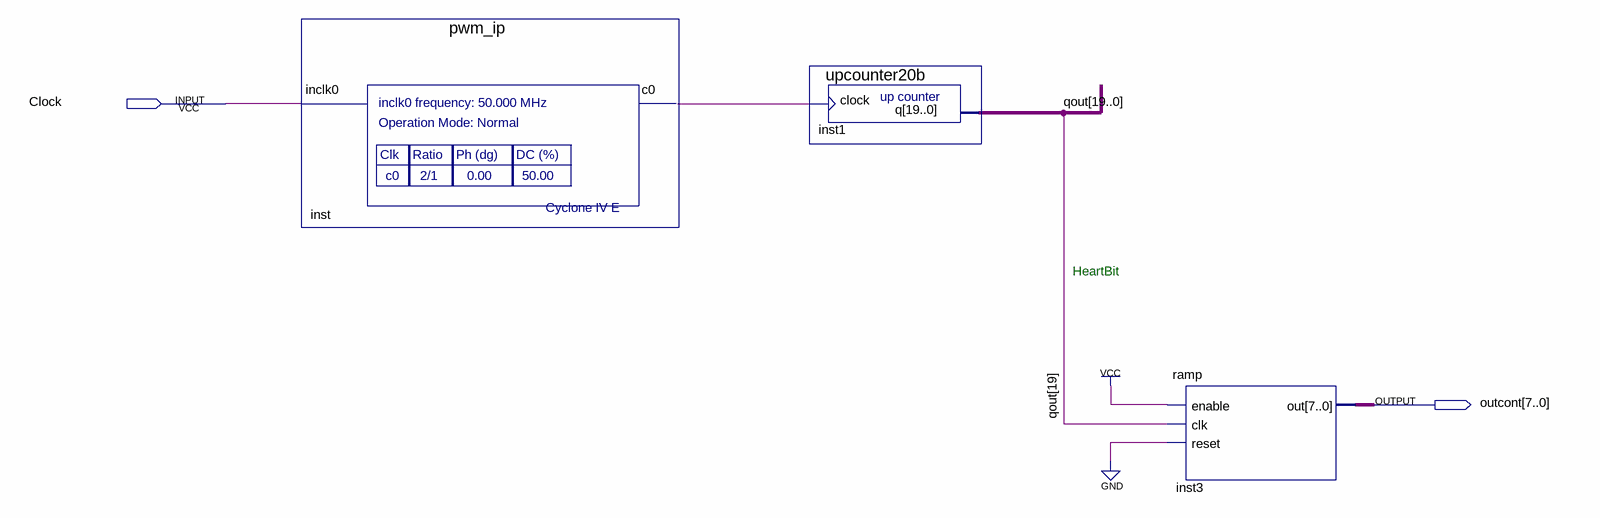
[diagram p0: schematic sheet]
// Quartus schematic PWMyLED.bdf as structural Verilog: 3 symbols, 2 pins
module PWMyLED (
  input  Clock,
  output [7:0] outcont
);

  wire inst_c0;
  wire [19:0] qout;

  pwm_ip inst (.inclk0(Clock), .c0(inst_c0));
  upcounter20b inst1 (.clock(inst_c0), .q(qout));
  ramp inst3 (.enable(1'b1), .clk(qout[19]), .reset(1'b0), .out(outcont));

  // Notes on the sheet:
  //   HeartBit
endmodule
